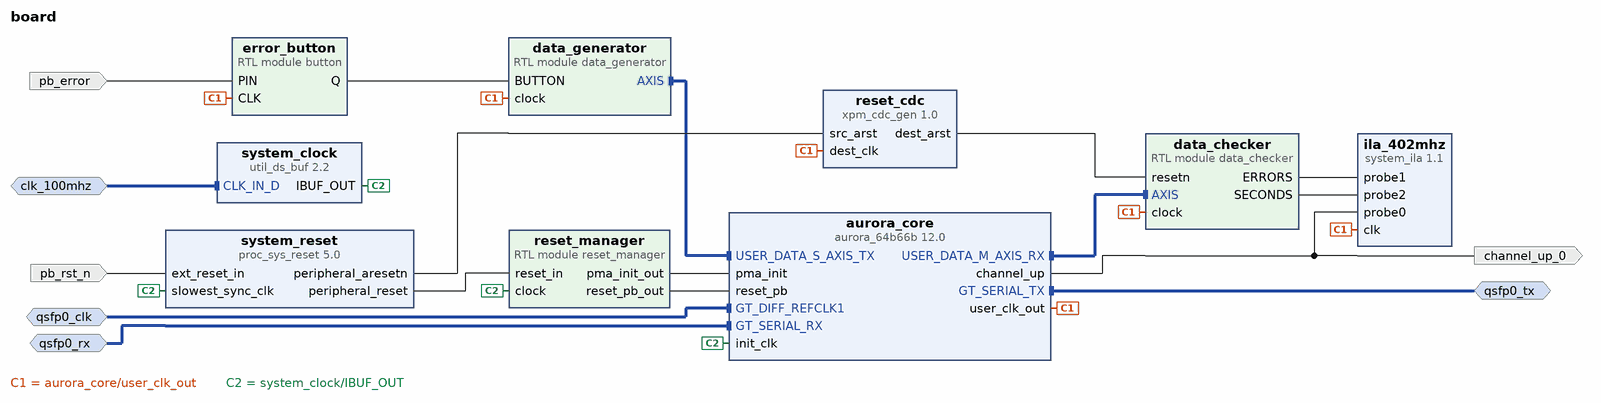
[diagram p0: block diagram of the top level]
# Vivado block design board, xczu19eg-ffvc1760-2-i, Vivado 2021.1
create_bd_design board

create_bd_intf_port -mode Slave -vlnv xilinx.com:interface:diff_clock_rtl:1.0 clk_100mhz
create_bd_intf_port -mode Slave -vlnv xilinx.com:interface:diff_clock_rtl:1.0 qsfp0_clk
set_property -dict {CONFIG.FREQ_HZ 322265625} [get_bd_intf_ports qsfp0_clk]
create_bd_intf_port -mode Master -vlnv xilinx.com:display_aurora:GT_Serial_Transceiver_Pins_TX_rtl:1.0 qsfp0_tx
create_bd_intf_port -mode Slave -vlnv xilinx.com:display_aurora:GT_Serial_Transceiver_Pins_RX_rtl:1.0 qsfp0_rx
create_bd_port -dir I -type rst pb_rst_n
create_bd_port -dir O channel_up_0
create_bd_port -dir I pb_error

create_bd_cell -type ip -vlnv xilinx.com:ip:util_ds_buf:2.2 system_clock
create_bd_cell -type ip -vlnv xilinx.com:ip:proc_sys_reset:5.0 system_reset
create_bd_cell -type ip -vlnv xilinx.com:ip:system_ila:1.1 ila_402mhz
set_property -dict [list \
  CONFIG.C_MON_TYPE NATIVE \
  CONFIG.C_NUM_MONITOR_SLOTS 1 \
  CONFIG.C_NUM_OF_PROBES 3 \
  CONFIG.C_PROBE0_TYPE 0 \
  CONFIG.C_PROBE1_TYPE 0 \
  CONFIG.C_PROBE2_TYPE 0 \
  CONFIG.C_PROBE3_TYPE 0 \
  CONFIG.C_SLOT_0_APC_EN 0 \
  CONFIG.C_SLOT_0_AXI_DATA_SEL 1 \
  CONFIG.C_SLOT_0_AXI_TRIG_SEL 1 \
  CONFIG.C_SLOT_0_INTF_TYPE xilinx.com:interface:axis_rtl:1.0 \
  CONFIG.C_SLOT_0_TYPE 0 \
  CONFIG.C_SLOT_1_APC_EN 0 \
  CONFIG.C_SLOT_1_AXI_DATA_SEL 1 \
  CONFIG.C_SLOT_1_AXI_TRIG_SEL 1 \
  CONFIG.C_SLOT_1_INTF_TYPE xilinx.com:interface:axis_rtl:1.0 \
] [get_bd_cells ila_402mhz]
create_bd_cell -type module -reference reset_manager reset_manager
create_bd_cell -type ip -vlnv xilinx.com:ip:aurora_64b66b:12.0 aurora_core
set_property -dict [list \
  CONFIG.CHANNEL_ENABLE {X0Y12 X0Y13 X0Y14 X0Y15} \
  CONFIG.C_AURORA_LANES 4 \
  CONFIG.C_GT_CLOCK_1 GTYQ0 \
  CONFIG.C_GT_TYPE GTY \
  CONFIG.C_LINE_RATE 25.78125 \
  CONFIG.C_REFCLK_FREQUENCY 322.265625 \
  CONFIG.C_REFCLK_SOURCE MGTREFCLK0_of_Quad_X0Y3 \
  CONFIG.C_START_LANE X0Y12 \
  CONFIG.C_START_QUAD Quad_X0Y3 \
  CONFIG.C_UCOLUMN_USED left \
  CONFIG.SupportLevel 1 \
  CONFIG.drp_mode Disabled \
  CONFIG.interface_mode Streaming \
] [get_bd_cells aurora_core]
create_bd_cell -type module -reference data_generator data_generator
create_bd_cell -type module -reference button error_button
set_property -dict {CONFIG.ACTIVE_STATE 0 CONFIG.CLOCKS_PER_USEC 100} [get_bd_cells error_button]
create_bd_cell -type ip -vlnv xilinx.com:ip:xpm_cdc_gen:1.0 reset_cdc
set_property -dict {CONFIG.CDC_TYPE xpm_cdc_async_rst} [get_bd_cells reset_cdc]
create_bd_cell -type module -reference data_checker data_checker

# ---- connections ----

connect_bd_intf_net -intf_net CLK_IN_D_0_1 [get_bd_intf_ports clk_100mhz] [get_bd_intf_pins system_clock/CLK_IN_D]
connect_bd_intf_net [get_bd_intf_ports qsfp0_tx] [get_bd_intf_pins aurora_core/GT_SERIAL_TX]
connect_bd_intf_net [get_bd_intf_pins data_checker/AXIS] [get_bd_intf_pins aurora_core/USER_DATA_M_AXIS_RX]
connect_bd_intf_net -intf_net data_generator_0_AXIS [get_bd_intf_pins data_generator/AXIS] [get_bd_intf_pins aurora_core/USER_DATA_S_AXIS_TX]
connect_bd_intf_net [get_bd_intf_ports qsfp0_clk] [get_bd_intf_pins aurora_core/GT_DIFF_REFCLK1]
connect_bd_intf_net [get_bd_intf_ports qsfp0_rx] [get_bd_intf_pins aurora_core/GT_SERIAL_RX]
connect_bd_net -net ERRORS [get_bd_pins data_checker/ERRORS] [get_bd_pins ila_402mhz/probe1]
connect_bd_net -net PIN_0_1 [get_bd_ports pb_error] [get_bd_pins error_button/PIN]
connect_bd_net -net SECONDS [get_bd_pins data_checker/SECONDS] [get_bd_pins ila_402mhz/probe2]
connect_bd_net -net aurora_64b66b_0_user_clk_out [get_bd_pins aurora_core/user_clk_out] \
  [get_bd_pins ila_402mhz/clk] [get_bd_pins data_generator/clock] [get_bd_pins error_button/CLK] \
  [get_bd_pins reset_cdc/dest_clk] [get_bd_pins data_checker/clock]
connect_bd_net -net button_0_Q [get_bd_pins error_button/Q] [get_bd_pins data_generator/BUTTON]
connect_bd_net -net ext_reset_in_0_1 [get_bd_ports pb_rst_n] [get_bd_pins system_reset/ext_reset_in]
# net gt_reset_out has one end: 
connect_bd_net -net qsfp_data_channel_up_0 [get_bd_pins aurora_core/channel_up] [get_bd_ports channel_up_0] [get_bd_pins ila_402mhz/probe0]
connect_bd_net [get_bd_pins reset_manager/pma_init_out] [get_bd_pins aurora_core/pma_init]
connect_bd_net [get_bd_pins reset_manager/reset_pb_out] [get_bd_pins aurora_core/reset_pb]
connect_bd_net [get_bd_pins system_clock/IBUF_OUT] \
  [get_bd_pins system_reset/slowest_sync_clk] [get_bd_pins reset_manager/clock] [get_bd_pins aurora_core/init_clk]
connect_bd_net [get_bd_pins system_reset/peripheral_aresetn] [get_bd_pins reset_cdc/src_arst]
connect_bd_net [get_bd_pins system_reset/peripheral_reset] [get_bd_pins reset_manager/reset_in]
connect_bd_net -net xpm_cdc_gen_0_dest_arst [get_bd_pins reset_cdc/dest_arst] [get_bd_pins data_checker/resetn]
set_property HDL_ATTRIBUTE.DEBUG true [get_bd_nets ERRORS]
set_property HDL_ATTRIBUTE.MARK_DEBUG true [get_bd_nets ERRORS]
set_property HDL_ATTRIBUTE.DEBUG true [get_bd_nets SECONDS]
set_property HDL_ATTRIBUTE.MARK_DEBUG true [get_bd_nets SECONDS]
set_property HDL_ATTRIBUTE.DEBUG true [get_bd_nets gt_reset_out]
set_property HDL_ATTRIBUTE.MARK_DEBUG true [get_bd_nets gt_reset_out]
set_property HDL_ATTRIBUTE.DEBUG true [get_bd_nets qsfp_data_channel_up_0]
set_property HDL_ATTRIBUTE.MARK_DEBUG true [get_bd_nets qsfp_data_channel_up_0]

validate_bd_design
save_bd_design
